# Altium schematic sheet 第二周.SchDoc
size A2
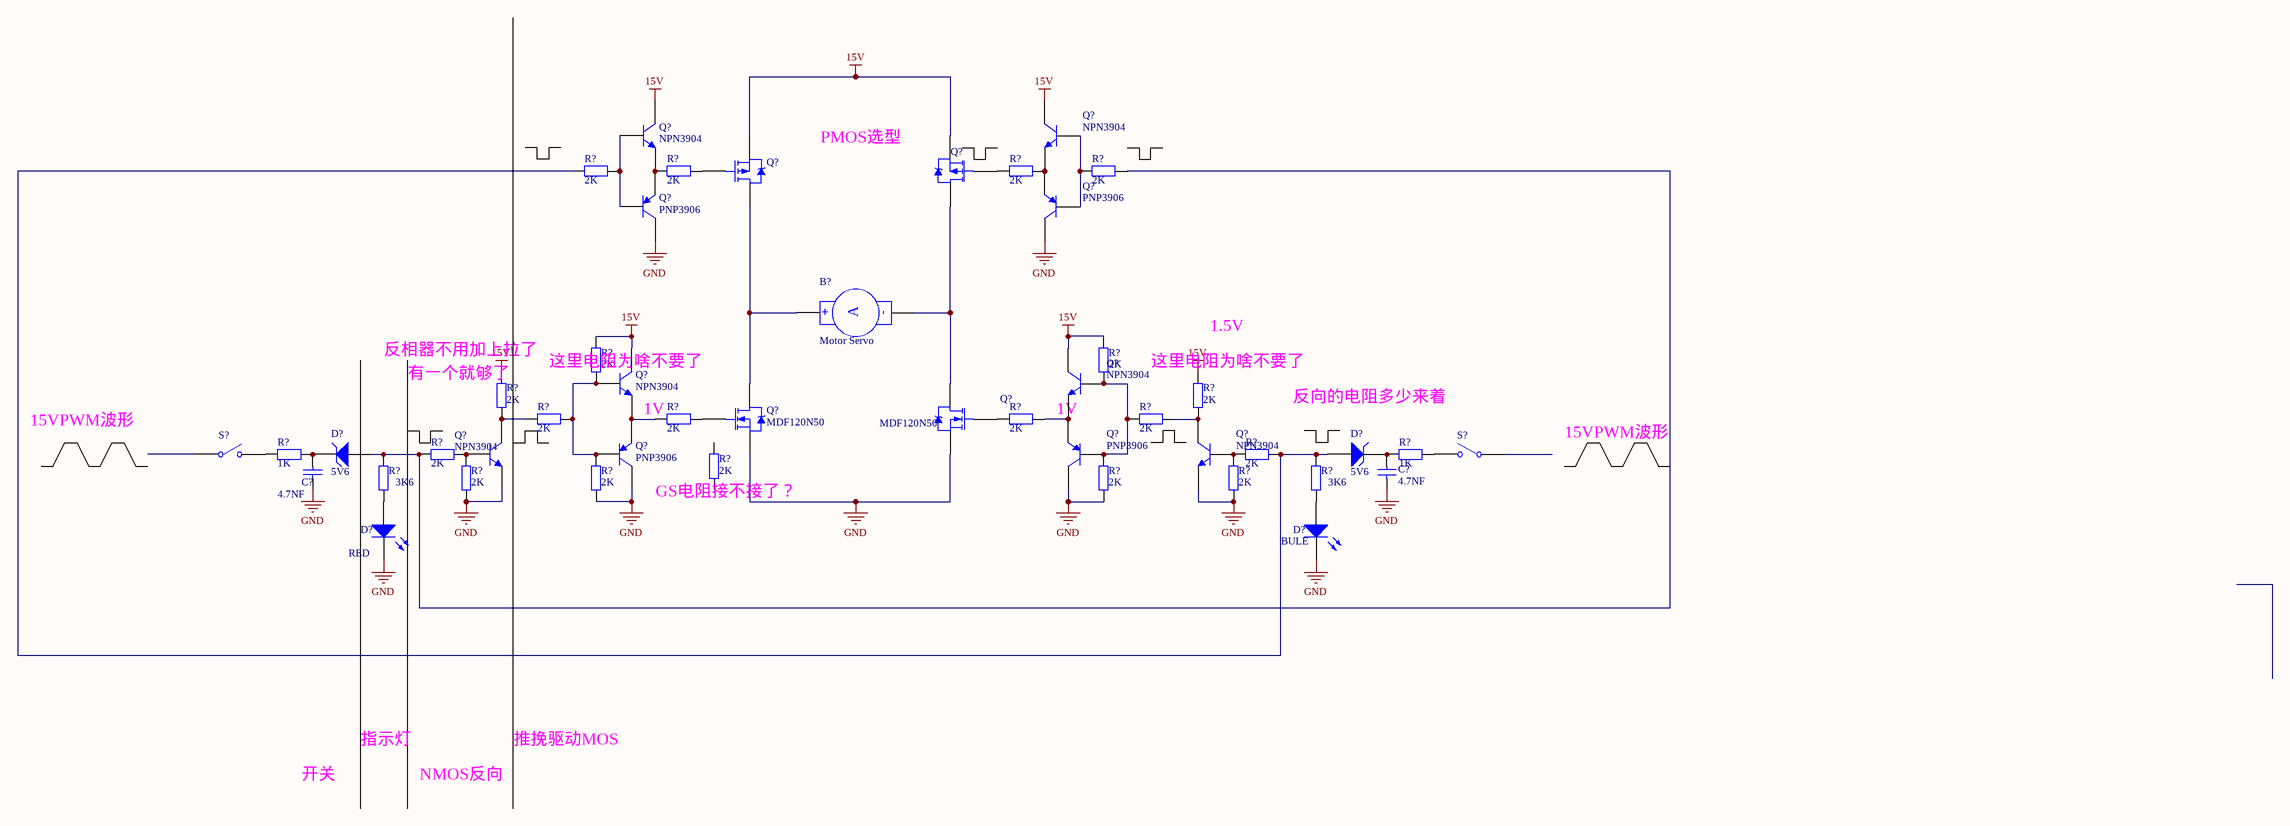
[diagram p0: 第二周.SchDoc]

## Parts
(Parts that share a designator on the sheet are numbered #1, #2 ... from top to bottom, then left to right.)
B?  Motor Servo  [RAD-0.4]
C?#1  4.7NF  [RAD-0.3]
C?#2  4.7NF  [RAD-0.3]
D?#1  5V6  [DIODE-0.7]
D?#2  5V6  [DIODE-0.7]
D?#3  RED  [LED-1]
D?#4  BULE  [LED-1]
Q?#1  NPN3904  [TO-226-AA]
Q?#2  NPN3904  [TO-226-AA]
Q?#3  PMOS-2  [TO-220AB]  (value not drawn)
Q?#4  PMOS-2  [TO-220AB]  (value not drawn)
Q?#5  PNP3906  [SOT-23B_N]
Q?#6  PNP3906  [SOT-23B_N]
Q?#7  NPN3904  [TO-226-AA]
Q?#8  NPN3904  [TO-226-AA]
Q?#9  MDF120N50  [TO-220AB]
Q?#10  MDF120N50  [TO-220AB]
Q?#11  NPN3904  [TO-226-AA]
Q?#12  PNP3906  [SOT-23B_N]
Q?#13  PNP3906  [SOT-23B_N]
Q?#14  NPN3904  [TO-226-AA]
R?#1  2K  [AXIAL-0.4]
R?#2  2K  [AXIAL-0.4]
R?#3  2K  [AXIAL-0.4]
R?#4  2K  [AXIAL-0.4]
R?#5  2K  [AXIAL-0.4]
R?#6  2K  [AXIAL-0.4]
R?#7  2K  [AXIAL-0.4]
R?#8  2K  [AXIAL-0.4]
R?#9  2K  [AXIAL-0.4]
R?#10  2K  [AXIAL-0.4]
R?#11  2K  [AXIAL-0.4]
R?#12  2K  [AXIAL-0.4]
R?#13  1K  [AXIAL-0.4]
R?#14  1K  [AXIAL-0.4]
R?#15  2K  [AXIAL-0.4]
R?#16  2K  [AXIAL-0.4]
R?#17  2K  [AXIAL-0.4]
R?#18  3K6  [AXIAL-0.4]
R?#19  2K  [AXIAL-0.4]
R?#20  2K  [AXIAL-0.4]
R?#21  2K  [AXIAL-0.4]
R?#22  2K  [AXIAL-0.4]
R?#23  3K6  [AXIAL-0.4]
S?#1  SW-SPST  [SPST-2]  (value not drawn)
S?#2  SW-SPST  [SPST-2]  (value not drawn)

## Nets
15V: Q?#1.1(C) Q?#2.1(C) Q?#3.3(S) Q?#4.3(S) Q?#7.1(C) Q?#8.1(C) R?#5.2 R?#6.2 R?#7.2 R?#12.2
GND: C?#1.1 C?#2.1 D?#3.2(K) D?#4.2(K) Q?#5.1(C) Q?#6.1(C) Q?#9.3(S) Q?#10.3(S) Q?#11.3(E) Q?#12.1(C) Q?#13.1(C) Q?#14.3(E) R?#19.1 R?#20.1 R?#21.1 R?#22.1
NetB?_1: B?.1(+) Q?#3.2(D) Q?#9.2(D)
NetB?_2: B?.2(-) Q?#4.2(D) Q?#10.2(D)
NetC?#1_2: C?#1.2 D?#1.2(K) R?#13.2
NetC?#2_2: C?#2.2 D?#2.2(K) R?#14.2
NetD?#1_1: D?#1.1(A) R?#4.1 R?#15.1 R?#18.2
NetD?#2_1: D?#2.1(A) R?#1.1 R?#16.1 R?#23.2
NetD?#3_1: D?#3.1(A) R?#18.1
NetD?#4_1: D?#4.1(A) R?#23.1
NetQ?#1_2: Q?#1.2(B) Q?#5.2(B) R?#1.2
NetQ?#1_3: Q?#1.3(E) Q?#5.3(E) R?#2.2
NetQ?#2_2: Q?#2.2(B) Q?#6.2(B) R?#4.2
NetQ?#2_3: Q?#2.3(E) Q?#6.3(E) R?#3.1
NetQ?#3_1: Q?#3.1(G) R?#2.1
NetQ?#4_1: Q?#4.1(G) R?#3.2
NetQ?#7_2: Q?#7.2(B) Q?#12.2(B) R?#5.1 R?#8.2 R?#20.2
NetQ?#7_3: Q?#7.3(E) Q?#12.3(E) R?#9.1
NetQ?#8_2: Q?#8.2(B) Q?#13.2(B) R?#6.1 R?#11.2 R?#21.2
NetQ?#8_3: Q?#8.3(E) Q?#13.3(E) R?#10.1
NetQ?#9_1: Q?#9.1(G) R?#9.2
NetQ?#10_1: Q?#10.1(G) R?#10.2
NetQ?#11_1: Q?#11.1(C) R?#7.1 R?#8.1
NetQ?#11_2: Q?#11.2(B) R?#15.2 R?#19.2
NetQ?#14_1: Q?#14.1(C) R?#11.1 R?#12.1
NetQ?#14_2: Q?#14.2(B) R?#16.2 R?#22.2
NetR?#13_1: R?#13.1 S?#1.2(NO)
NetR?#14_1: R?#14.1 S?#2.2(NO)

Not connected (* = marked no-connect by the designer): R?#17 1 2; S?#1 1(COMMON); S?#2 1(COMMON)

## Notes on the sheet
- PMOS选型
- 反相器不用加上拉了
- 这里电阻为啥不要了
- 1.5V
- 15VPWM波形
- 有一个就够了
- 1V
- (near R?#12) 反向的电阻多少来着
- (near R?#17) GS电阻接不接了？
- 开关
- 指示灯
- NMOS反向
- 推挽驱动MOS
- (in symbol Motor Servo) A

## Library data of the parts
B? = Motor Servo: Servo Motor; Published: 24-Mar-1999; LatestRevisionDate: 17-Jul-2002; LatestRevisionNote: Re-released for DXP Platform.; PackageReference: RAD-0.4; Publisher: Altium Limited; PackageDescription: Radial Cap, Thru-Hole; 2 Leads; 0.4 in Pin Spacing
C?#1 C?#2 = Cap: Capacitor; Value: 100pF; Published: 8-Jun-2000; LatestRevisionDate: 17-Jul-2002; LatestRevisionNote: Re-released for DXP Platform.; PackageReference: RAD-0.3; Publisher: Altium Limited; PackageDescription: Radial Cap, Thru-Hole; 2 Leads; 0.3 in Pin Spacing
D?#1 D?#2 = D Zener: Zener Diode; Published: 8-Jun-2000; LatestRevisionDate: 17-Jul-2002; LatestRevisionNote: Re-released for DXP Platform.; PackageReference: DIODE-0.7; Publisher: Altium Limited; PackageDescription: Diode, Thru-Hole; 2 Leads; 0.7 in Pin Spacing
D?#3 D?#4 = LED1: Typical RED GaAs LED; Published: 8-Jun-2000; LatestRevisionDate: 08-Jul-2005; LatestRevisionNote: Mech Layer 1 removed.; PackageReference: LED-1; Publisher: Altium Limited; PackageDescription: LED; 2 Leads
Q?#1 Q?#2 Q?#7 Q?#8 Q?#11 Q?#14 = NPN: NPN Bipolar Transistor; Published: 8-Jun-2000; LatestRevisionDate: 17-Jul-2002; LatestRevisionNote: Re-released for DXP Platform.; PackageReference: TO-226-AA; Publisher: Altium Limited; PackageDescription: TO, Flat Index; 3 In-Line, Axial Leads; Body Dia. 4.8mm; Leads 0.55 x 0.51 mm (max); Code_JEDEC: TO-226-AA
Q?#3 Q?#4 = PMOS-2: P-Channel Power MOSFET; Note: Pin 4 not drawn and electrically connected to Pin 2.; Published: 8-Jun-2000; LatestRevisionDate: 17-Jul-2002; LatestRevisionNote: Re-released for DXP Platform.; DatasheetVersion: PD-9.390D; PackageVersion: Feb-1997; PackageReference: TO-220AB; Publisher: Altium Limited; PackageDescription: TO, Thru-Hole, Vertical, Heatsink Mounted; 3 In-Line Leads; Pitch 2.54 mm; ComponentLink1Description: Manufacturer Link; ComponentLink1URL: http://www.irf.com/
Q?#5 Q?#6 Q?#12 Q?#13 = PNP: PNP Bipolar Transistor; Published: 8-Jun-2000; LatestRevisionDate: 29-May-2009; LatestRevisionNote: IPC-7351 Footprint Added.; PackageVersion: Aug-1999; PackageReference: SOT-23B; Publisher: Altium Limited; PackageDescription: 3-Pin SOT-23 Package 0.95 mm Pitch, 2.4 mm Lead Span
Q?#9 Q?#10 = NMOS-2: N-Channel Power MOSFET; Note: Pin 2 is electrically connected to pin 4.; Published: 8-Jun-2000; LatestRevisionDate: 17-Jul-2002; LatestRevisionNote: Re-released for DXP Platform.; DatasheetVersion: PD-9.814; PackageVersion: Feb-1997; PackageReference: TO-220AB; Publisher: Altium Limited; PackageDescription: TO, Thru-Hole, Vertical, Heatsink Mounted; 3 In-Line Leads; Pitch 2.54 mm; ComponentLink1Description: Manufacturer Link; ComponentLink1URL: http://www.irf.com/
R?#1-R?#12 R?#15-R?#23 = Res2: Resistor; Value: 1K; Published: 8-Jun-2000; LatestRevisionDate: 17-Jul-2002; LatestRevisionNote: Re-released for DXP Platform.; PackageReference: AXIAL-0.4; Publisher: Altium Limited; PackageDescription: Axial Device, Thru-Hole; 2 Leads; 0.4 in Pin Spacing
R?#13 R?#14 = Res2: Resistor; Published: 8-Jun-2000; LatestRevisionDate: 17-Jul-2002; LatestRevisionNote: Re-released for DXP Platform.; PackageReference: AXIAL-0.4; Publisher: Altium Limited; PackageDescription: Axial Device, Thru-Hole; 2 Leads; 0.4 in Pin Spacing; Value: 1K
S?#1 S?#2 = SW-SPST: Single-Pole, Single-Throw Switch; Published: 24-Mar-1999; LatestRevisionDate: 17-Jul-2002; LatestRevisionNote: Re-released for DXP Platform.; PackageReference: SPST-2; Publisher: Altium Limited; PackageDescription: Switch; 2 Leads